# EAGLE design Integrador (EAGLE 9.5.2)
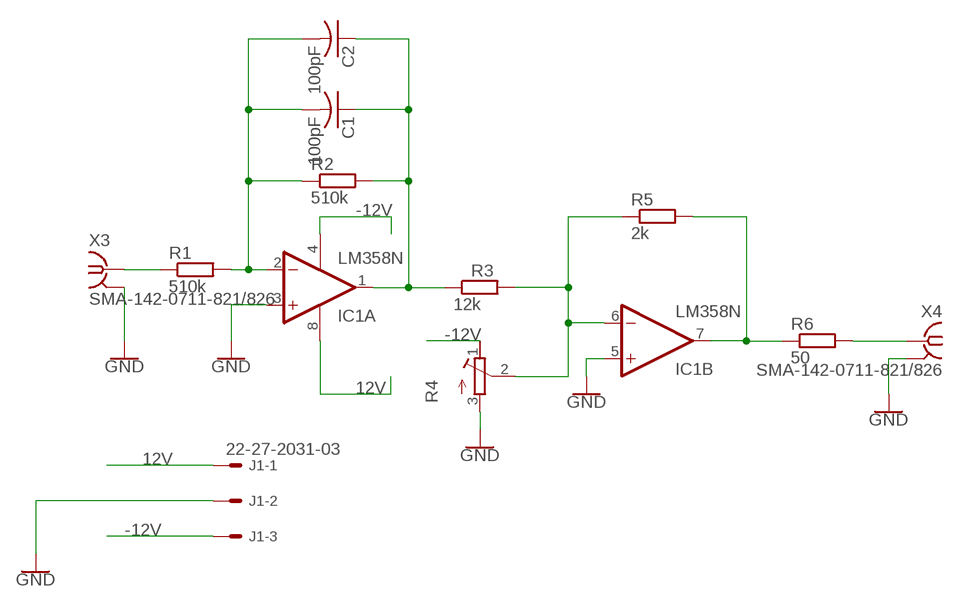
[diagram p0: schematic, sheet 1]

## Parts
C1  100pF  C-US025-030X050  [C025-030X050]
C2  100pF  C-US025-030X050  [C025-030X050]
IC1  LM358N  [DIL08]
J1  22-27-2031-03  [6410-03]
R1  510k  R-EU_0207/10  [0207/10]
R2  510k  R-EU_0207/10  [0207/10]
R3  12k  R-EU_0207/10  [0207/10]
R4  R-TRIMM3006P  [RTRIM3006P]
R5  2k  R-EU_0207/10  [0207/10]
R6  50  R-EU_0207/10  [0207/10]
X3  SMA-142-0711-821/826  [J502-ND-142-0711-821/826]
X4  SMA-142-0711-821/826  [J502-ND-142-0711-821/826]

## Nets
12V: IC1.8(P:V+) J1.1
-12V: IC1.4(P:V-) J1.3 R4.1(E)
GND: IC1.3(A:+IN) IC1.5(B:+IN) J1.2 R4.3(A) X3.G@1 X3.G@2 X3.G@3 X3.G@4 X4.G@1 X4.G@2 X4.G@3 X4.G@4
N$1: R1.1 X3.1
N$2: C1.2 C2.2 IC1.2(A:-IN) R1.2 R2.1
N$4: C1.1 C2.1 IC1.1(A:OUT) R2.2 R3.1
N$5: IC1.6(B:-IN) R3.2 R4.2(S) R5.1
N$6: IC1.7(B:OUT) R5.2 R6.1
N$7: R6.2 X4.1

## Library data of the parts
C1 C2 = rcl:C-US: CAPACITOR, American symbol; SPICEPREFIX: C
IC1 = linear:LM358: OP AMP also LM158; LM258; LM2904 Source: http://cache.national.com/ds/LM/LM158.pdf
J1 = con-molex:22-?-03: CONNECTOR wire to board 2.54 mm (.1 inch) pitch header; MF: MOLEX; OC_FARNELL: unknown; OC_NEWARK: unknown
R1-R3 R5 R6 = rcl:R-EU_: RESISTOR, European symbol; SPICEPREFIX: R
R4 = rcl:R-TRIMM: Trimm resistor; SPICEMODEL: X; SPICEPREFIXL: POT
X3 X4 = con-coax:SMA-: SMA 50 Ohm End Launch Jack Receptacle - Round Contact Johnson Components Source: www.johnsoncomponents.com .. J502-ND.pdf; MF: JOHNSON COMPONENTS; MPN: 142-0711-821; OC_FARNELL: 1019328; OC_NEWARK: 16F3627

## Board
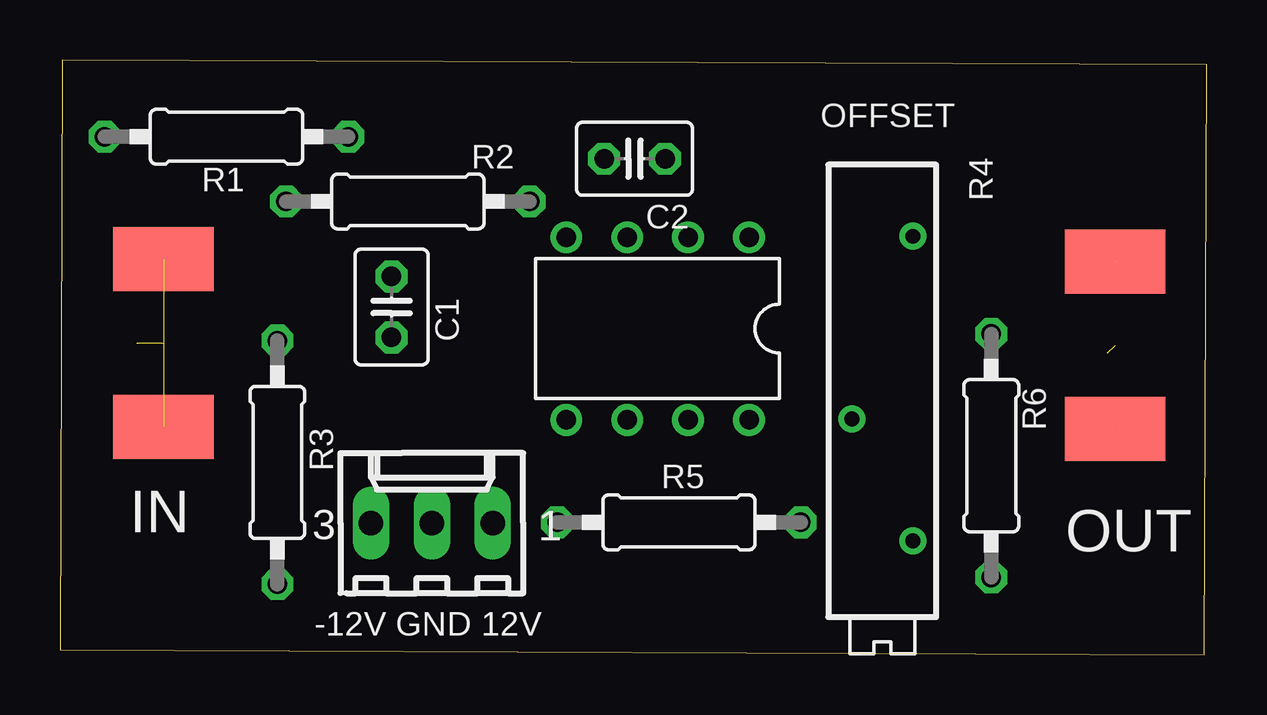
[diagram p1: board, top side]
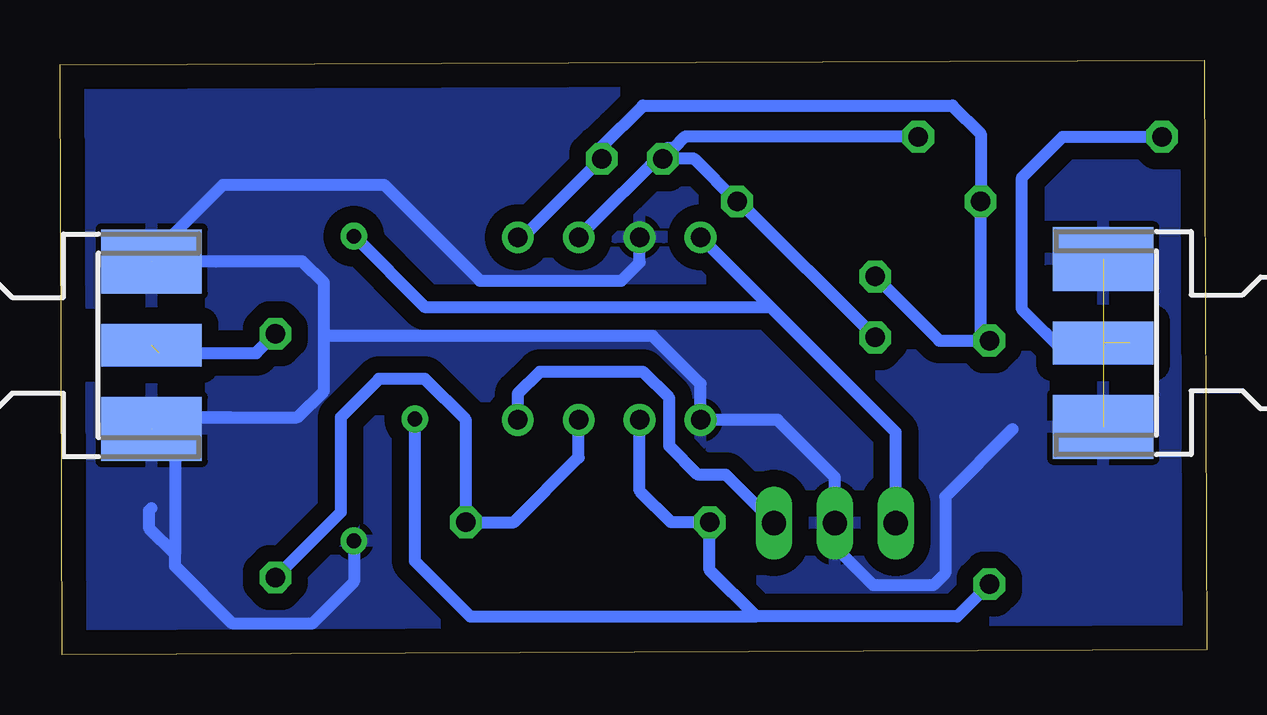
[diagram p2: board, bottom side, seen from below]

Size 47.8 x 24.8 mm. Coordinates in mm from the lower left corner, seen from the top.
Outline: 0,0.2 47.7,0 47.8,24.6 0.1,24.8 0,0.2
Copper layers (1*16): Top 0.035mm / dielectric 1.5mm / Bottom 0.035mm
Design rules "default": minimum track width 6mil, minimum drill 0.35mm, track to track 6mil, track to pad 6mil, pad to pad 6mil, via to via 6mil, smd to smd 6mil, copper to edge 40mil, drill to drill 6mil, minimum pad ring 10mil, minimum via ring 8mil, stop-mask expansion 4mil, vias tented up to drill 0mil, thermal gap 10mil

### Footprints (pad centres in the part's own frame; a part is rotated, then mirrored left to right if it is on the bottom)
C025-030X050 = drill 0.813 octagon: 1 -1.27,0; 2 1.27,0
DIL08 = drill 0.813 pad 1.27: 1 -3.81,-3.81; 2 -1.27,-3.81; 3 1.27,-3.81; 4 3.81,-3.81; 5 3.81,3.81; 6 1.27,3.81; 7 -1.27,3.81; 8 -3.81,3.81
6410-03 = drill 1.016 long: 1 2.54,0; 2 0,0; 3 -2.54,0
0207/10 = drill 0.813 octagon: 1 -5.08,0; 2 5.08,0
RTRIM3006P = drill 0.61: 1 -7.62,1.27; 2 0,-1.27; 3 5.08,1.27
J502-ND-142-0711-821/826 = smd 4.191 x 1.778: 1 2.115,0 | smd 4.191 x 2.667: G@1 2.115,3.495; G@2 2.115,-3.495 | smd 4.191 x 2.667 bottom: G@3 2.115,3.495; G@4 2.115,-3.495

### Placement (x,y rotation side)
C1  13.82,14.5 270 top
C2  23.95,20.68 180 top
IC1  24.91,13.6 180 top
J1  15.5,5.49 0 top
R1  6.94,21.6 0 top
R2  14.5,18.9 180 top
R3  9.06,8.02 270 top
R4  34.28,9.83 270 top
R5  25.8,5.52 0 top
R6  38.82,8.3 90 top
X3  2.2,13 180 bottom
X4  46.1,12.9 0 bottom

### Tracks (layer width: path | path; a pad name or v marks a point on that pad's centre or on a via)
12V
  Bottom 0.5: J1.1 20.05,7.5 21.2,7.5 22.4,8.7 22.4,10.7 23.5,11.8 27.8,11.8 28.72,10.88 IC1.8
-12V
  Bottom 0.5: J1.3 12.96,9.27 18.2,14.51 | 18.2,14.51 IC1.4 | R4.1 32.61,14.51 18.2,14.51
GND  (5 unrouted)
  Bottom 0.5: 8.09,9.4 10.9,6.6 10.9,3.4 11.4,2.9 13.9,2.9 15.5,4.5 J1.2 15.5,7.4 17.89,9.79 IC1.5 21.1,11.3 23.1,13.3 36.8,13.3 | 40.7,9.9 44,9.9 | 36.8,13.3 36.8,11 37.91,9.89 43,9.89 43,4.2 | 36.8,13.3 36.8,15.5 37.7,16.4 41.3,16.4 | 41.3,16.4 42.3,16.4 | 43.78,16.82 41,19.6 34.3,19.6 30.3,15.6 24.4,15.6 23.64,16.36 IC1.3 | R4.3 35.55,3.05 37.3,1.3 40.6,1.3 43,3.7 43,4.2 | 41.3,16.39 41.3,16.4 | 43.98,6.12 44.1,6 44.1,5.3 43,4.2
  pour Bottom (isolate 0.7): 1,0 1,24.6 47.8,24.6 47.8,0
N$1  (1 unrouted)
  Bottom 0.5: R1.1 6,21.6 7.7,19.9 7.7,14.4 6.7,13.4 6.2,12.9 6.1,12.8 3.4,12.8 3.2,13
N$2
  Bottom 0.5: C1.2 19.49,18.9 R2.1 21.36,20.68 C2.2 22.23,21.13 | R1.2 21.76,21.6 22.23,21.13 | 22.23,21.13 22.46,21.13 IC1.2
N$4
  Bottom 0.5: C1.1 11.15,13.1 R3.1 9.42,13.46 R2.2 9.42,21.72 10.6,22.9 23.5,22.9 25.22,21.18 C2.1 28.49,17.41 IC1.1
N$5
  Bottom 0.5: R3.2 10.4,1.6 18.8,1.6 | 18.8,1.6 20.72,3.52 R5.1 22.32,5.52 23.64,6.84 IC1.6 | R4.2 33.01,3.91 30.7,1.6 18.8,1.6
N$6
  Bottom 0.5: IC1.7 26.18,8.22 28.88,5.52 R5.2 30.88,9.78 32.6,11.5 34.5,11.5 36.1,9.9 36.1,5.94 R6.1
N$7  (1 unrouted)
  Bottom 0.5: R6.2 39.62,12.58 43.67,12.58

### Text on the board
tNames: OFFSET | IN | OUT | -12V GND 12V